# Altium schematic sheet Optocouplers.SchDoc
size A4; SheetNumber: 5; SheetTotal: 8
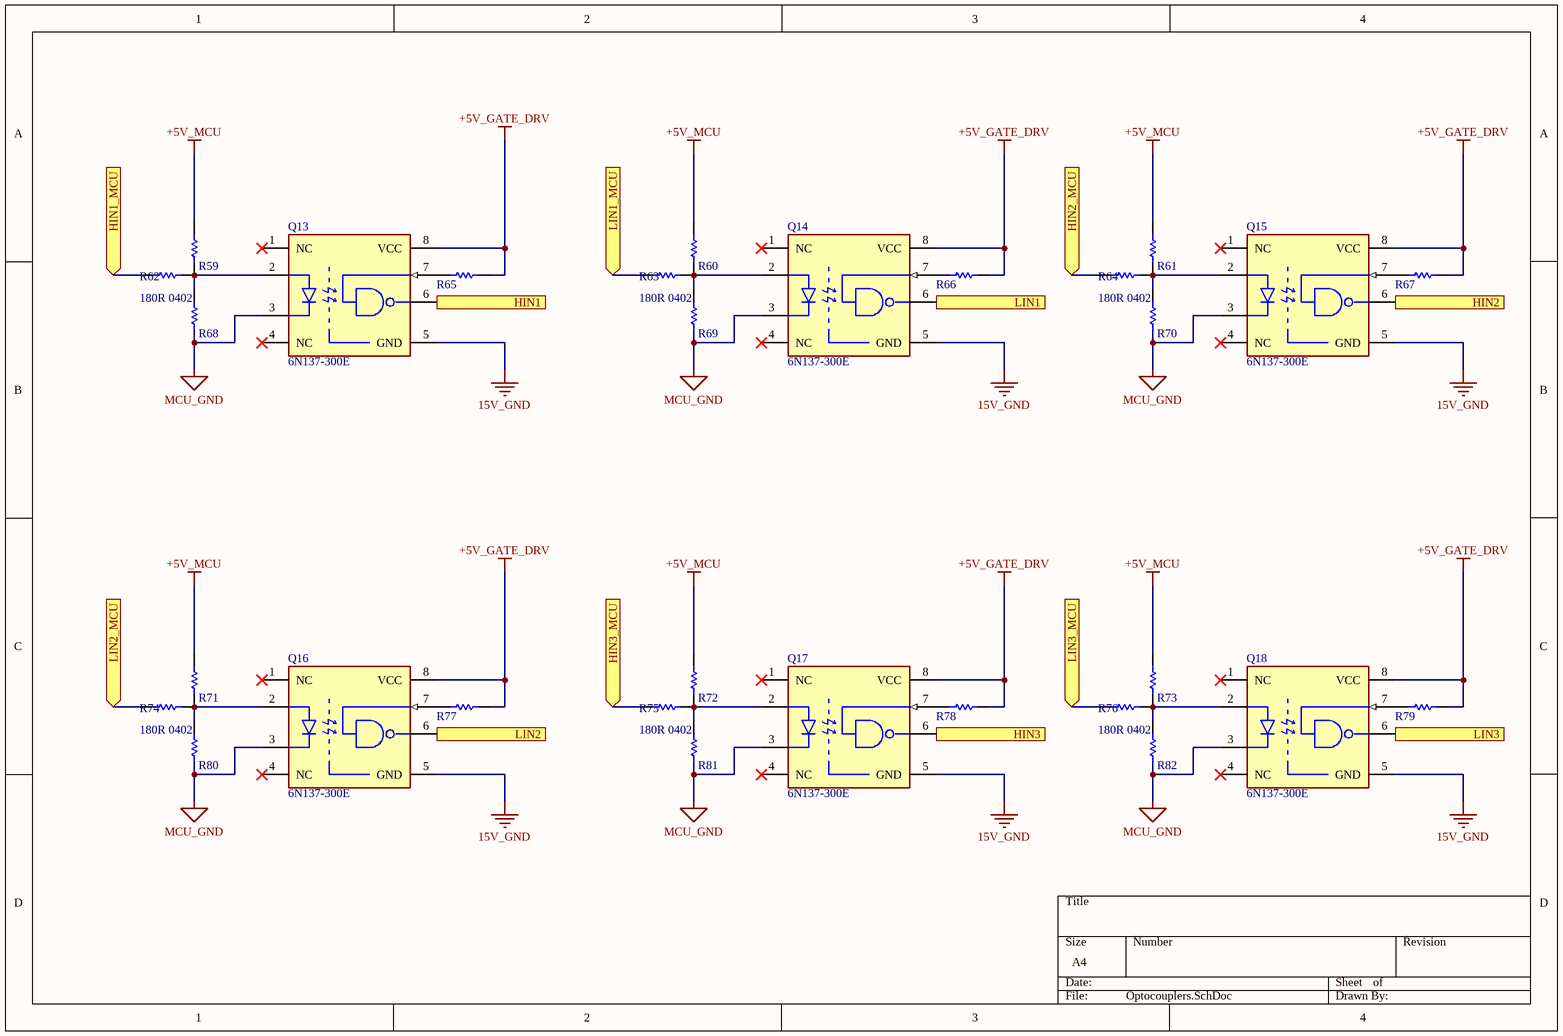
[diagram p0: Optocouplers.SchDoc]

## Parts
Q13  6N137-300E  [FP-6N137-300E-MFG]
Q14  6N137-300E  [FP-6N137-300E-MFG]
Q15  6N137-300E  [FP-6N137-300E-MFG]
Q16  6N137-300E  [FP-6N137-300E-MFG]
Q17  6N137-300E  [FP-6N137-300E-MFG]
Q18  6N137-300E  [FP-6N137-300E-MFG]
R59  0R 0603  [R0603]  (value not drawn)
R60  0R 0603  [R0603]  (value not drawn)
R61  0R 0603  [R0603]  (value not drawn)
R62  180R 0402  [R08050402]
R63  180R 0402  [R08050402]
R64  180R 0402  [R08050402]
R65  0R 0603  [R0603]  (value not drawn)
R66  0R 0603  [R0603]  (value not drawn)
R67  0R 0603  [R0603]  (value not drawn)
R68  0R 0603  [R0603]  (value not drawn)
R69  0R 0603  [R0603]  (value not drawn)
R70  0R 0603  [R0603]  (value not drawn)
R71  0R 0603  [R0603]  (value not drawn)
R72  0R 0603  [R0603]  (value not drawn)
R73  0R 0603  [R0603]  (value not drawn)
R74  180R 0402  [R08050402]
R75  180R 0402  [R08050402]
R76  180R 0402  [R08050402]
R77  0R 0603  [R0603]  (value not drawn)
R78  0R 0603  [R0603]  (value not drawn)
R79  0R 0603  [R0603]  (value not drawn)
R80  0R 0603  [R0603]  (value not drawn)
R81  0R 0603  [R0603]  (value not drawn)
R82  0R 0603  [R0603]  (value not drawn)

## Ports
HIN1 (out), HIN1_MCU (in), HIN2 (out), HIN2_MCU (in), HIN3 (out), HIN3_MCU (in), LIN1 (out), LIN1_MCU (in), LIN2 (out), LIN2_MCU (in), LIN3 (out), LIN3_MCU (in)

## Nets
15V_GND: Q13.5(GND) Q14.5(GND) Q15.5(GND) Q16.5(GND) Q17.5(GND) Q18.5(GND)
+5V_GATE_DRV: Q13.8(VCC) Q14.8(VCC) Q15.8(VCC) Q16.8(VCC) Q17.8(VCC) Q18.8(VCC) R65.2 R66.2 R67.2 R77.2 R78.2 R79.2
+5V_MCU: R59.2 R60.2 R61.2 R71.2 R72.2 R73.2
MCU_GND: Q13.3(C) Q14.3(C) Q15.3(C) Q16.3(C) Q17.3(C) Q18.3(C) R68.1 R69.1 R70.1 R80.1 R81.1 R82.1
HIN1: Q13.6(VO) ; port HIN1
HIN1_MCU: R62.1 ; port HIN1_MCU
HIN2: Q15.6(VO) ; port HIN2
HIN2_MCU: R64.1 ; port HIN2_MCU
HIN3: Q17.6(VO) ; port HIN3
HIN3_MCU: R75.1 ; port HIN3_MCU
LIN1: Q14.6(VO) ; port LIN1
LIN1_MCU: R63.1 ; port LIN1_MCU
LIN2: Q16.6(VO) ; port LIN2
LIN2_MCU: R74.1 ; port LIN2_MCU
LIN3: Q18.6(VO) ; port LIN3
LIN3_MCU: R76.1 ; port LIN3_MCU
NetQ13_2: Q13.2(A) R59.1 R62.2 R68.2
NetQ13_7: Q13.7(VE) R65.1
NetQ14_2: Q14.2(A) R60.1 R63.2 R69.2
NetQ14_7: Q14.7(VE) R66.1
NetQ15_2: Q15.2(A) R61.1 R64.2 R70.2
NetQ15_7: Q15.7(VE) R67.1
NetQ16_2: Q16.2(A) R71.1 R74.2 R80.2
NetQ16_7: Q16.7(VE) R77.1
NetQ17_2: Q17.2(A) R72.1 R75.2 R81.2
NetQ17_7: Q17.7(VE) R78.1
NetQ18_2: Q18.2(A) R73.1 R76.2 R82.2
NetQ18_7: Q18.7(VE) R79.1

Not connected (* = marked no-connect by the designer): Q13 1(NC)* 4(NC)*; Q14 1(NC)* 4(NC)*; Q15 1(NC)* 4(NC)*; Q16 1(NC)* 4(NC)*; Q17 1(NC)* 4(NC)*; Q18 1(NC)* 4(NC)*

## Library data of the parts
Q13-Q18 = CMP-18400-000015-1: 6N137 – High-Speed Optocoupler-SOP8; Manufacturer: Broadcom; Min Supply Voltage: 4.5V; Forward Voltage: 1.5V; Turn Off Delay Time: 50ns; Standoff Height: 0.505mm; Reverse Voltage: 5V; Isolation Voltage: 3750Vrms; Forward Current: 10mA; Turn On Delay Time: 48ns; Max Supply Voltage: 5.5V; Package: 0; Automotive: No; Lead Free: Yes; ComponentLink2Description: Datasheet; Temperature: -40°C to +85°C; Device Class L3: unset; Height: 4.455mm; Ambient Temperature Range Low: -40°C; Digikey Description: OPTOISO 3.75KV OPN COLL 8DIP GW; Temperature Range Low: -40°C; ComponentLink2URL: https://docs.broadcom.com/docs/AV02-0940EN; Mouser Description: High Speed Optocouplers 10 Mb/s 3750Vrms; Category: Trans; Ambient Temperature Range High: +85°C; RoHS: TRUE; Octopart: https://octopart.com/6n137-300e-broadcom-71125550; Manufacturer Part Number: 6N137-300E; Device Class L1: Optoelectronics; Device Class L2: Optocouplers; Temperature Range High: +85°C; Price per piece: 36; Product URL: https://sharvielectronics.com/product/6n137-high-speed-optocoupler-sop8/; Datasheet: https://sharvielectronics.com/wp-content/uploads/2020/11/6n137.pdf
  Q14-Q18: Parameter 1: *
R59-R61 R65-R73 R77-R82 = R0000 0603: 0 Ohm 1/10 Watt Resistor 1% Tolerance RC0603FR-070RL – 0603 Package; Price per piece: 0.97; Product URL: https://sharvielectronics.com/product/0-ohm-1-10-watt-resistor-1-tolerance-rc0603fr-070rl-0603-package/; Datasheet: https://drive.google.com/file/d/1pkLQT_RQ1i35oFQcGREpZr7Oy3Ppi-ZT/view?usp=sharing
R62-R64 R74-R76 = R0805-0402: 180 Ohm 1/4 Watt Resistor – 0402 Package; Price per piece: 0.85; Product URL: https://sharvielectronics.com/product/180-ohm-1-4-watt-resistor-0402-package-pack-of-20/; Datasheet: https://sharvielectronics.com/wp-content/uploads/2020/09/smd_Resistor_0603_0805_1206.pdf